# Altium schematic sheet 3V3_Supply.SchDoc
size A4; SheetNumber: 6; SheetTotal: 18
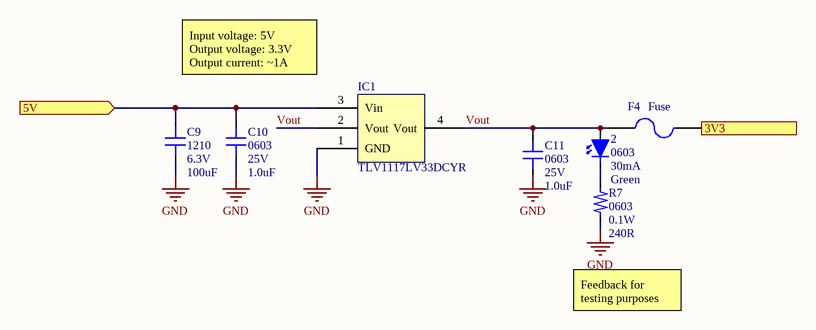
[diagram p0: 3V3_Supply.SchDoc]

## Parts
2  0603  value Green  Rating: 30mA  [LED_0603]
C9  1210  value 100uF  Rating: 6.3V  [C_1210]
C10  0603  value 1.0uF  Rating: 25V  [C_0603]
C11  0603  value 1.0uF  Rating: 25V  [C_0603]
F4  Fuse  [FUSE_1206]
IC1  TLV1117LV33DCYR  [SOT-223]
R7  0603  value 240R  Rating: 0.1W  [R_0603]

## Ports
3V3 (out), 5V (in)

## Nets
GND: C9.1(C1) C10.1(C1) C11.1(C1) IC1.1(GND) R7.1(R1)
3V3: F4.2 ; port 3V3
5V: C9.2(C2) C10.2(C2) IC1.3(Vin) ; port 5V
Vout: 2.2(DA) C11.2(C2) F4.1 IC1.2(Vout) IC1.4(Vout)
Net2_1: 2.1(DC) R7.2(R2)

## Notes on the sheet
- Input voltage: 5V
  Output voltage: 3.3V
  Output current: ~1A
- Feedback for testing purposes

## Library data of the parts
2 = Opt_FYLS-0603UGC_LED_0603_Green_30mA_Diode_LED: Note: 40mcd; Tolerance: 5%; Distributor: Lomex; Link: http://lomex.hu/hu/webshop/#/page,0/stype,1/sidx,10/instock,0/search,95-03-08; Order Number: 95-03-08; Package: 0603; Part Number: FYLS-0603UGC; Price (HUF): 10; Type: LED; ID: Opt_FYLS-0603UGC_LED_0603_Green_30mA_Diode_LED
C9 = 885012109004: Type: Chip Capacitor; Tolerance: 10%; ID: 1210_100uF_6.3V; Part Number: 885012109004; Order Number: 885012109004; Distributor: Würth; Link: http://katalog.we-online.com/en/pbs/WCAP-CSGP-1210/885012209071?_ga=2.179279780.1074345052.1540129169-1833754390.1539103246; Price (HUF): 0; Package: 1210; NI Part Number: -; NI PEN/DEB: -
C10 C11 = CL10A105KA8NNNC: Type: Chip Capacitor; Tolerance: 10%; ID: Cap_0603_1.0uF_25V_Chip; Part Number: CL10A105KA8NNNC; Order Number: 82-07-86; Distributor: Lomex; Link: http://lomex.hu/hu/webshop/#/page,0/search,82-07-86/stype,1/sidx,1; Price (HUF): 2.00; Package: 0603; NI Part Number: -; NI PEN/DEB: -
F4 = 1206SFS100F/63-2: NI part number: 766260-01; ID: Oth_1206SFS100F/63-2_FUSE_1206; Order number: 1843826; Rating: 63VDC; Type: Slow Blow; Value: 1A; NI PEN/DEB: DEB; Distributor: Farnell; Link: http://hu.farnell.com/te-connectivity-raychem/1206sfs100f-63-2/fuse-smd-1206-1a/dp/1843826; Package: FUSE_1206; Part Number: 1206SFS100F/63-2; Price (HUF): 239
IC1 = TLV1117LV33DCYR: Single Output LDO; ID: IC_TLV1117LV33DCYR_SOT-223; Distributor: TI; Link: http://www.ti.com/product/TLV1117LV?keyMatch=TLV1117LV33DCYR&tisearch=Search-EN-Everything; Note: TLV1117; Order number: TLV1117LV33DCYR; Package: SOT-223; Part Number: TLV1117LV33DCYR; Price (HUF): 64; Type: Single Output LDO; NI part number: -; NI PEN/DEB: -
R7 = CR-03JL7--240R: NI part number: 612640-01; Tolerance: 5%; Note: NI: not in stock; ID: Res_0603_240R_0.1W_Chip; NI PEN/DEB: DEB; Type: Chip Resistor; Part Number: CR-03JL7--240R; Order Number: 81-12-26; Distributor: Lomex; Link: http://lomex.hu/hu/webshop/#/page,0/search,81-12-26/stype,1/sidx,1; Price (HUF): 0.80; Package: 0603